# Altium schematic sheet SCH_SEGEMENTOS_SEGUNDERO_2.SchDoc
size A4
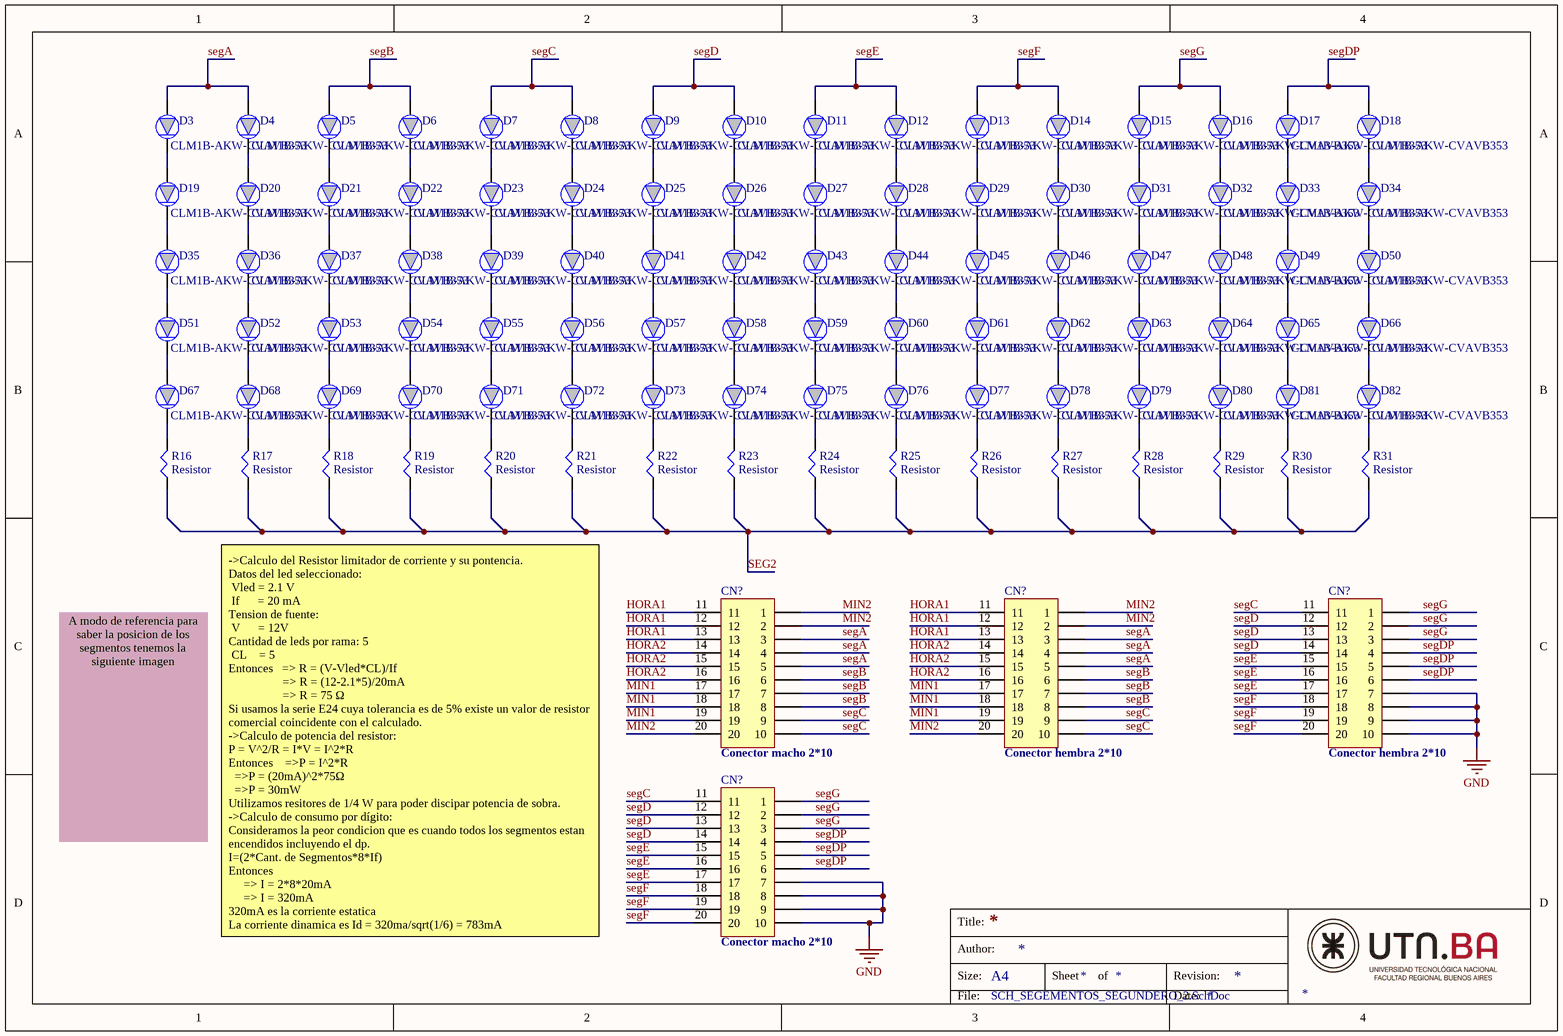
[diagram p0: SCH_SEGEMENTOS_SEGUNDERO_2.SchDoc]

## Parts
(Parts that share a designator on the sheet are numbered #1, #2 ... from top to bottom, then left to right.)
CN?#1  Conector macho 2*10
CN?#2  Conector hembra 2*10
CN?#3  Conector hembra 2*10
CN?#4  Conector macho 2*10
D3  CLM1B-AKW-CVAVB353
D4  CLM1B-AKW-CVAVB353
D5  CLM1B-AKW-CVAVB353
D6  CLM1B-AKW-CVAVB353
D7  CLM1B-AKW-CVAVB353
D8  CLM1B-AKW-CVAVB353
D9  CLM1B-AKW-CVAVB353
D10  CLM1B-AKW-CVAVB353
D11  CLM1B-AKW-CVAVB353
D12  CLM1B-AKW-CVAVB353
D13  CLM1B-AKW-CVAVB353
D14  CLM1B-AKW-CVAVB353
D15  CLM1B-AKW-CVAVB353
D16  CLM1B-AKW-CVAVB353
D17  CLM1B-AKW-CVAVB353
D18  CLM1B-AKW-CVAVB353
D19  CLM1B-AKW-CVAVB353
D20  CLM1B-AKW-CVAVB353
D21  CLM1B-AKW-CVAVB353
D22  CLM1B-AKW-CVAVB353
D23  CLM1B-AKW-CVAVB353
D24  CLM1B-AKW-CVAVB353
D25  CLM1B-AKW-CVAVB353
D26  CLM1B-AKW-CVAVB353
D27  CLM1B-AKW-CVAVB353
D28  CLM1B-AKW-CVAVB353
D29  CLM1B-AKW-CVAVB353
D30  CLM1B-AKW-CVAVB353
D31  CLM1B-AKW-CVAVB353
D32  CLM1B-AKW-CVAVB353
D33  CLM1B-AKW-CVAVB353
D34  CLM1B-AKW-CVAVB353
D35  CLM1B-AKW-CVAVB353
D36  CLM1B-AKW-CVAVB353
D37  CLM1B-AKW-CVAVB353
D38  CLM1B-AKW-CVAVB353
D39  CLM1B-AKW-CVAVB353
D40  CLM1B-AKW-CVAVB353
D41  CLM1B-AKW-CVAVB353
D42  CLM1B-AKW-CVAVB353
D43  CLM1B-AKW-CVAVB353
D44  CLM1B-AKW-CVAVB353
D45  CLM1B-AKW-CVAVB353
D46  CLM1B-AKW-CVAVB353
D47  CLM1B-AKW-CVAVB353
D48  CLM1B-AKW-CVAVB353
D49  CLM1B-AKW-CVAVB353
D50  CLM1B-AKW-CVAVB353
D51  CLM1B-AKW-CVAVB353
D52  CLM1B-AKW-CVAVB353
D53  CLM1B-AKW-CVAVB353
D54  CLM1B-AKW-CVAVB353
D55  CLM1B-AKW-CVAVB353
D56  CLM1B-AKW-CVAVB353
D57  CLM1B-AKW-CVAVB353
D58  CLM1B-AKW-CVAVB353
D59  CLM1B-AKW-CVAVB353
D60  CLM1B-AKW-CVAVB353
D61  CLM1B-AKW-CVAVB353
D62  CLM1B-AKW-CVAVB353
D63  CLM1B-AKW-CVAVB353
D64  CLM1B-AKW-CVAVB353
D65  CLM1B-AKW-CVAVB353
D66  CLM1B-AKW-CVAVB353
D67  CLM1B-AKW-CVAVB353
D68  CLM1B-AKW-CVAVB353
D69  CLM1B-AKW-CVAVB353
D70  CLM1B-AKW-CVAVB353
D71  CLM1B-AKW-CVAVB353
D72  CLM1B-AKW-CVAVB353
D73  CLM1B-AKW-CVAVB353
D74  CLM1B-AKW-CVAVB353
D75  CLM1B-AKW-CVAVB353
D76  CLM1B-AKW-CVAVB353
D77  CLM1B-AKW-CVAVB353
D78  CLM1B-AKW-CVAVB353
D79  CLM1B-AKW-CVAVB353
D80  CLM1B-AKW-CVAVB353
D81  CLM1B-AKW-CVAVB353
D82  CLM1B-AKW-CVAVB353
R16  Resistor
R17  Resistor
R18  Resistor
R19  Resistor
R20  Resistor
R21  Resistor
R22  Resistor
R23  Resistor
R24  Resistor
R25  Resistor
R26  Resistor
R27  Resistor
R28  Resistor
R29  Resistor
R30  Resistor
R31  Resistor

## Nets
GND: CN?#3.7 CN?#3.8 CN?#3.9 CN?#3.10 CN?#4.7 CN?#4.8 CN?#4.9 CN?#4.10
HORA1: CN?#1.11 CN?#1.12 CN?#1.13 CN?#2.11 CN?#2.12 CN?#2.13
HORA2: CN?#1.14 CN?#1.15 CN?#1.16 CN?#2.14 CN?#2.15 CN?#2.16
MIN1: CN?#1.17 CN?#1.18 CN?#1.19 CN?#2.17 CN?#2.18 CN?#2.19
MIN2: CN?#1.1 CN?#1.2 CN?#1.20 CN?#2.1 CN?#2.2 CN?#2.20
SEG2: R16.47 R17.47 R18.47 R19.47 R20.47 R21.47 R22.47 R23.47 R24.47 R25.47 R26.47 R27.47 R28.47 R29.47 R30.47 R31.47
segA: CN?#1.3 CN?#1.4 CN?#1.5 CN?#2.3 CN?#2.4 CN?#2.5 D3.12 D4.12
segB: CN?#1.6 CN?#1.7 CN?#1.8 CN?#2.6 CN?#2.7 CN?#2.8 D5.12 D6.12
segC: CN?#1.9 CN?#1.10 CN?#2.9 CN?#2.10 CN?#3.11 CN?#4.11 D7.12 D8.12
segD: CN?#3.12 CN?#3.13 CN?#3.14 CN?#4.12 CN?#4.13 CN?#4.14 D9.12 D10.12
segDP: CN?#3.4 CN?#3.5 CN?#3.6 CN?#4.4 CN?#4.5 CN?#4.6 D17.12 D18.12
segE: CN?#3.15 CN?#3.16 CN?#3.17 CN?#4.15 CN?#4.16 CN?#4.17 D11.12 D12.12
segF: CN?#3.18 CN?#3.19 CN?#3.20 CN?#4.18 CN?#4.19 CN?#4.20 D13.12 D14.12
segG: CN?#3.1 CN?#3.2 CN?#3.3 CN?#4.1 CN?#4.2 CN?#4.3 D15.12 D16.12
NetD3_11: D3.11 D19.12
NetD4_11: D4.11 D20.12
NetD5_11: D5.11 D21.12
NetD6_11: D6.11 D22.12
NetD7_11: D7.11 D23.12
NetD8_11: D8.11 D24.12
NetD9_11: D9.11 D25.12
NetD10_11: D10.11 D26.12
NetD11_11: D11.11 D27.12
NetD12_11: D12.11 D28.12
NetD13_11: D13.11 D29.12
NetD14_11: D14.11 D30.12
NetD15_11: D15.11 D31.12
NetD16_11: D16.11 D32.12
NetD17_11: D17.11 D33.12
NetD18_11: D18.11 D34.12
NetD19_11: D19.11 D35.12
NetD20_11: D20.11 D36.12
NetD21_11: D21.11 D37.12
NetD22_11: D22.11 D38.12
NetD23_11: D23.11 D39.12
NetD24_11: D24.11 D40.12
NetD25_11: D25.11 D41.12
NetD26_11: D26.11 D42.12
NetD27_11: D27.11 D43.12
NetD28_11: D28.11 D44.12
NetD29_11: D29.11 D45.12
NetD30_11: D30.11 D46.12
NetD31_11: D31.11 D47.12
NetD32_11: D32.11 D48.12
NetD33_11: D33.11 D49.12
NetD34_11: D34.11 D50.12
NetD35_11: D35.11 D51.12
NetD36_11: D36.11 D52.12
NetD37_11: D37.11 D53.12
NetD38_11: D38.11 D54.12
NetD39_11: D39.11 D55.12
NetD40_11: D40.11 D56.12
NetD41_11: D41.11 D57.12
NetD42_11: D42.11 D58.12
NetD43_11: D43.11 D59.12
NetD44_11: D44.11 D60.12
NetD45_11: D45.11 D61.12
NetD46_11: D46.11 D62.12
NetD47_11: D47.11 D63.12
NetD48_11: D48.11 D64.12
NetD49_11: D49.11 D65.12
NetD50_11: D50.11 D66.12
NetD51_11: D51.11 D67.12
NetD52_11: D52.11 D68.12
NetD53_11: D53.11 D69.12
NetD54_11: D54.11 D70.12
NetD55_11: D55.11 D71.12
NetD56_11: D56.11 D72.12
NetD57_11: D57.11 D73.12
NetD58_11: D58.11 D74.12
NetD59_11: D59.11 D75.12
NetD60_11: D60.11 D76.12
NetD61_11: D61.11 D77.12
NetD62_11: D62.11 D78.12
NetD63_11: D63.11 D79.12
NetD64_11: D64.11 D80.12
NetD65_11: D65.11 D81.12
NetD66_11: D66.11 D82.12
NetD67_11: D67.11 R16.48
NetD68_11: D68.11 R17.48
NetD69_11: D69.11 R18.48
NetD70_11: D70.11 R19.48
NetD71_11: D71.11 R20.48
NetD72_11: D72.11 R21.48
NetD73_11: D73.11 R22.48
NetD74_11: D74.11 R23.48
NetD75_11: D75.11 R24.48
NetD76_11: D76.11 R25.48
NetD77_11: D77.11 R26.48
NetD78_11: D78.11 R27.48
NetD79_11: D79.11 R28.48
NetD80_11: D80.11 R29.48
NetD81_11: D81.11 R30.48
NetD82_11: D82.11 R31.48

## Notes on the sheet
- A modo de referencia para saber la posicion de los segmentos tenemos la siguiente imagen
- ->Calculo del Resistor limitador de corriente y su pontencia.
  Datos del led seleccionado:
  Vled = 2.1 V
  If      = 20 mA
  Tension de fuente:
  V      = 12V
  Cantidad de leds por rama: 5
  CL    = 5
  Entonces   => R = (V-Vled*CL)/If
  => R = (12-2.1*5)/20mA
  => R = 75 Ω
  Si usamos la serie E24 cuya tolerancia es de 5% existe un valor de resistor comercial coincidente con el calculado.
  ->Calculo de potencia del resistor:
  P = V^2/R = I*V = I^2*R
  Entonces    =>P = I^2*R
  =>P = (20mA)^2*75Ω
  =>P = 30mW
  Utilizamos resitores de 1/4 W para poder discipar potencia de sobra.
  ->Calculo de consumo por dígito:
  Consideramos la peor condicion que es cuando todos los segmentos estan encendidos incluyendo el dp.
  I=(2*Cant. de Segmentos*8*If)
  Entonces
  => I = 2*8*20mA
  => I = 320mA
  320mA es la corriente estatica
  La corriente dinamica es Id = 320ma/sqrt(1/6) = 783mA
- Title:
- Size:
- Author:
- A4
- Sheet
- of
- Revision:
- File:
- Date:

## Library data of the parts
CN?#1-CN?#4 = CONN_2x10P: Connector Generic 10 Vias
D3-D82 = LED_DIODE: LED rojo 0805